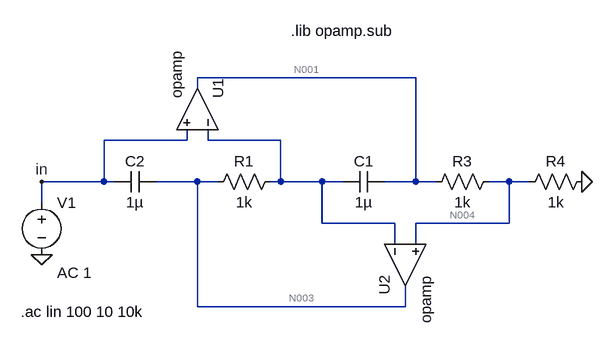
[diagram p0: schematic TP1-5B.asc]
TP1-5B.asc, the LTspice schematic file:
Version 4
SHEET 1 880 680
WIRE 400 48 64 48
WIRE 64 64 64 48
WIRE 48 144 48 128
WIRE 48 144 -80 144
WIRE 80 144 80 128
WIRE 192 144 80 144
WIRE -80 208 -80 144
WIRE -80 208 -176 208
WIRE -64 208 -80 208
WIRE 64 208 0 208
WIRE 96 208 64 208
WIRE 192 208 192 144
WIRE 192 208 176 208
WIRE 256 208 192 208
WIRE 288 208 256 208
WIRE 400 208 400 48
WIRE 400 208 352 208
WIRE 432 208 400 208
WIRE 544 208 512 208
WIRE 576 208 544 208
WIRE -176 240 -176 208
WIRE 256 272 256 208
WIRE 368 272 256 272
WIRE 544 272 544 208
WIRE 544 272 400 272
WIRE 368 304 368 272
WIRE 400 304 400 272
WIRE 64 400 64 208
WIRE 384 400 384 368
WIRE 384 400 64 400
FLAG -176 320 0
FLAG 656 208 0
FLAG -176 208 in
SYMBOL OpAmps\\opamp 128 96 M270
SYMATTR InstName U1
SYMBOL OpAmps\\opamp 320 336 M90
SYMATTR InstName U2
SYMBOL res 528 192 R90
WINDOW 0 0 56 VBottom 2
WINDOW 3 32 56 VTop 2
SYMATTR InstName R3
SYMATTR Value 1k
SYMBOL res 672 192 R90
WINDOW 0 0 56 VBottom 2
WINDOW 3 32 56 VTop 2
SYMATTR InstName R4
SYMATTR Value 1k
SYMBOL voltage -176 224 R0
WINDOW 123 24 124 Left 2
WINDOW 39 0 0 Left 0
SYMATTR Value2 AC 1
SYMATTR InstName V1
SYMATTR Value ""
SYMBOL cap 352 192 R90
WINDOW 0 0 32 VBottom 2
WINDOW 3 32 32 VTop 2
SYMATTR InstName C1
SYMATTR Value 1µ
SYMBOL cap 0 192 R90
WINDOW 0 0 32 VBottom 2
WINDOW 3 32 32 VTop 2
SYMATTR InstName C2
SYMATTR Value 1µ
SYMBOL res 192 192 R90
WINDOW 0 0 56 VBottom 2
WINDOW 3 32 56 VTop 2
SYMATTR InstName R1
SYMATTR Value 1k
TEXT 208 -24 Left 2 !.lib opamp.sub
TEXT -208 408 Left 2 !.ac lin 100 10 10k

The netlist it stands for:
* TP1-5B.asc
XU1 N002 in N001 opamp Aol=100K GBW=10Meg  ; pins invin noninvin out
XU2 N002 N004 N003 opamp Aol=100K GBW=10Meg  ; pins invin noninvin out
R3 N004 N001 1k
R4 0 N004 1k
V1 in 0 AC 1
C1 N001 N002 1µ
C2 N003 in 1µ
R1 N002 N003 1k
.lib opamp.sub
.ac lin 100 10 10k
.backanno
.end

* Results of the author's LTspice run, read from the files saved beside the schematic
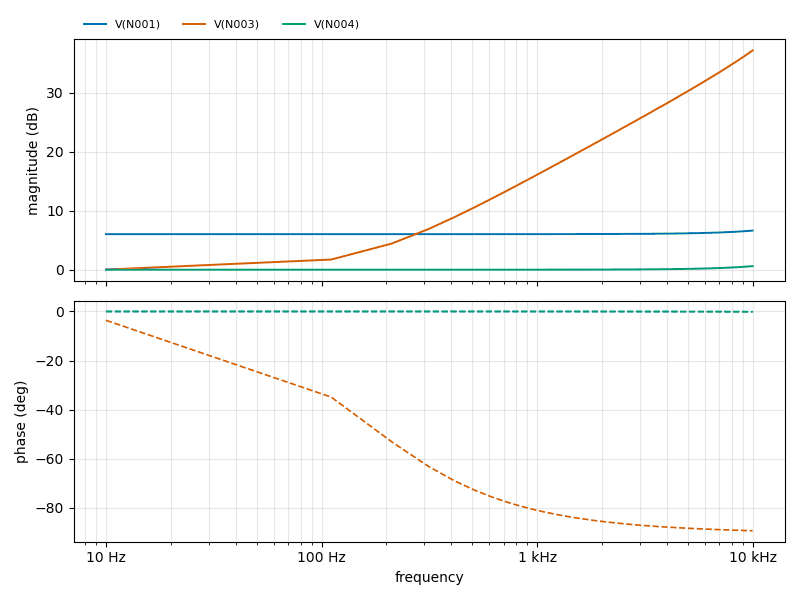
[diagram p1: AC Analysis of TP1-5B.asc, plotted from the saved traces]
* AC Analysis, 1 run:
*   V(N001): 6.02 dB at 10 Hz, 6.62 dB at 10 kHz, peak 6.62 dB at 10 kHz
*   V(N003): 0.02 dB at 10 Hz, 37.13 dB at 10 kHz, peak 37.13 dB at 10 kHz, 3 dB below the peak at 7.513 kHz
*   V(N004): -0.00 dB at 10 Hz, 0.60 dB at 10 kHz, peak 0.60 dB at 10 kHz